# EAGLE schematic HotFireBoard (EAGLE 9.0.1)
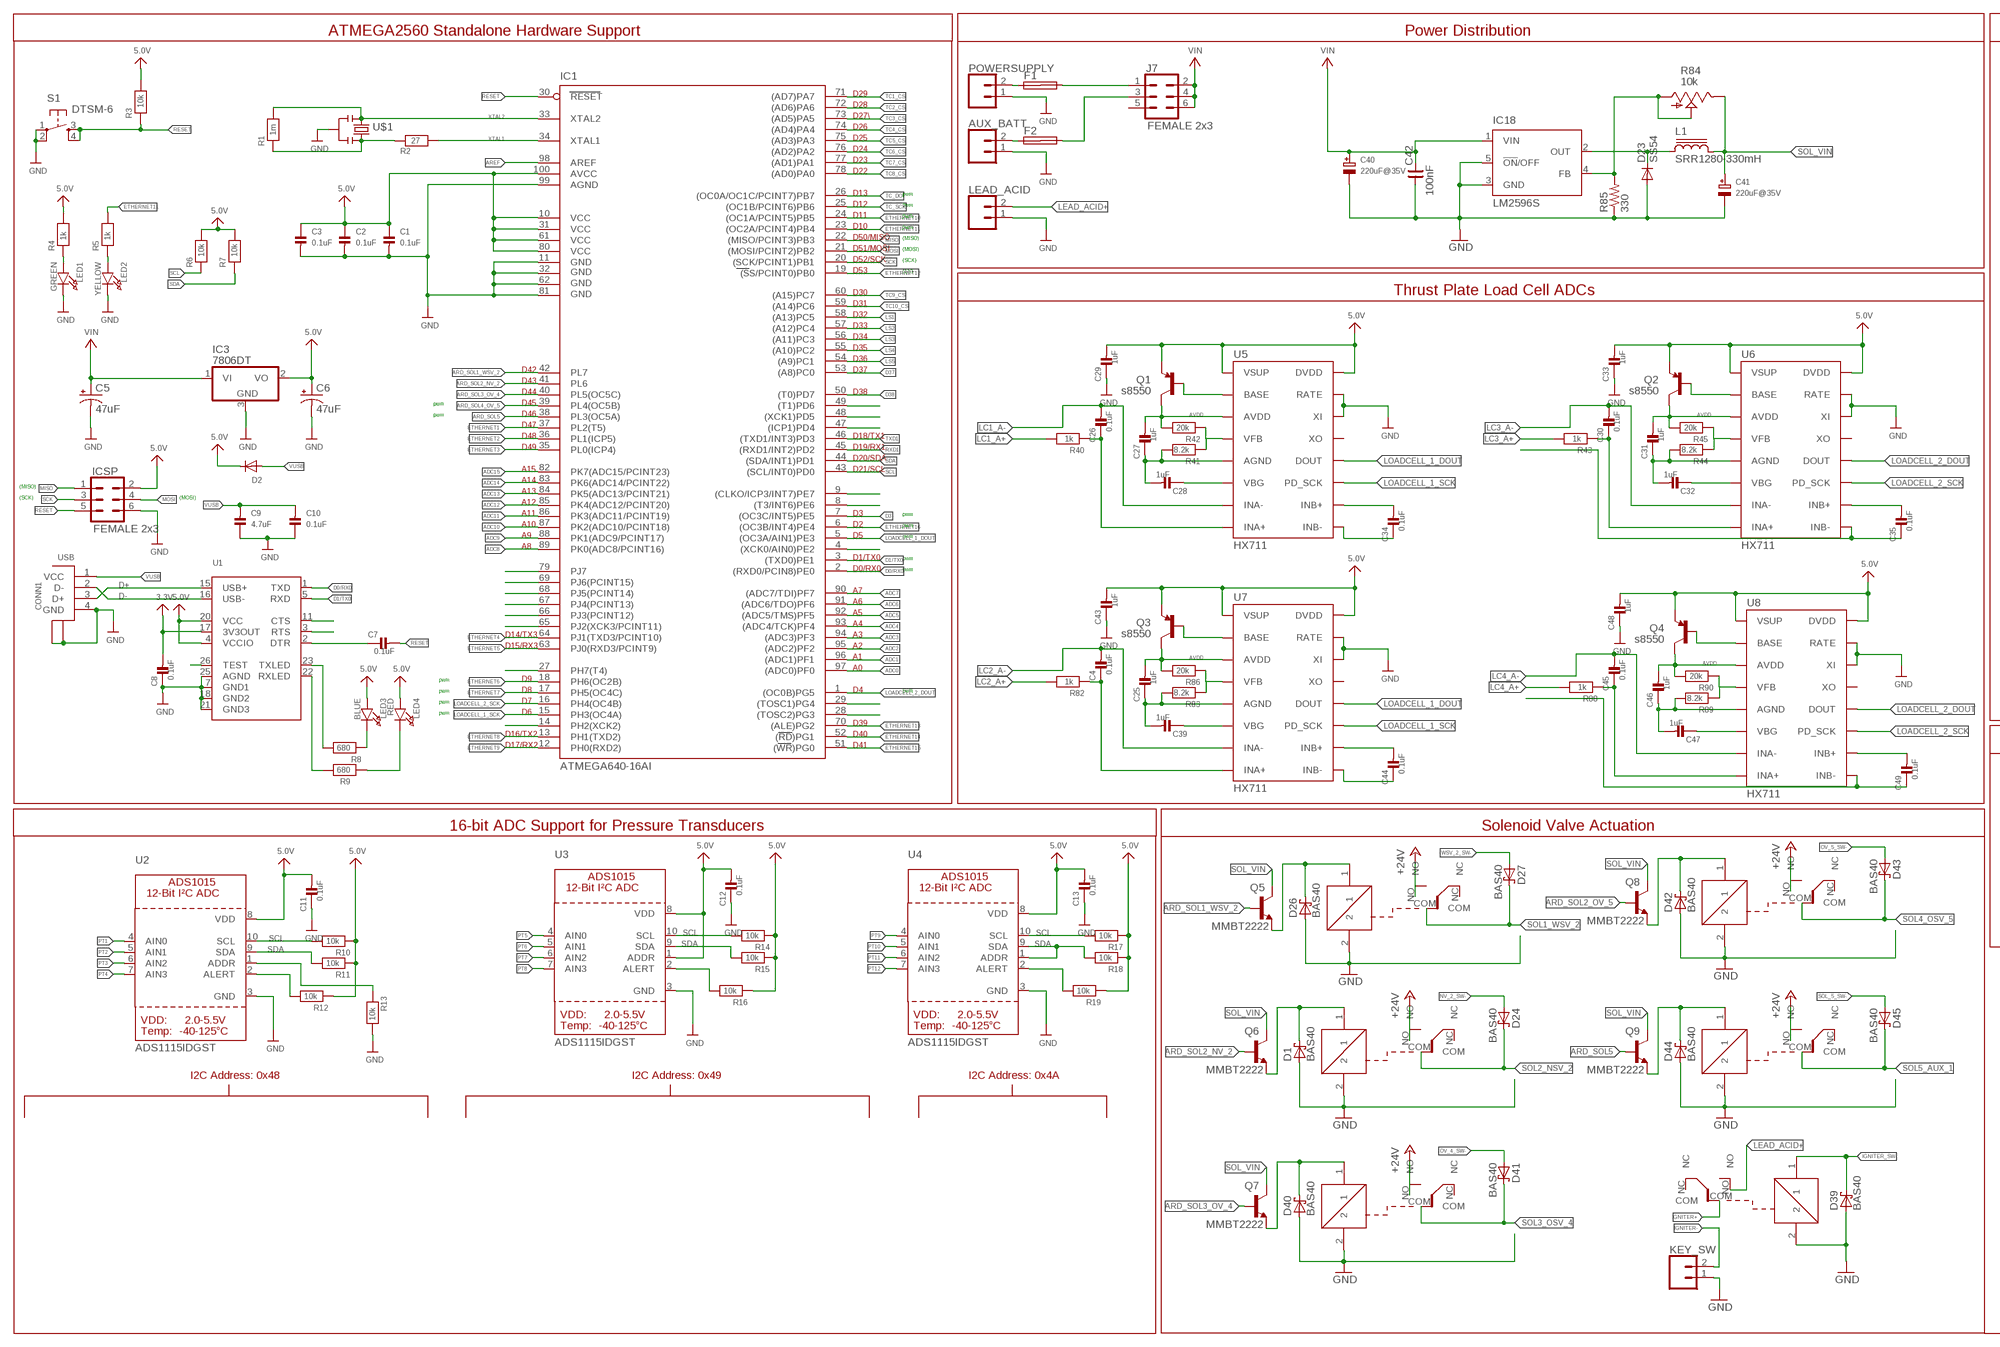
[diagram p0: schematic, sheet 1, part 1 of 3]
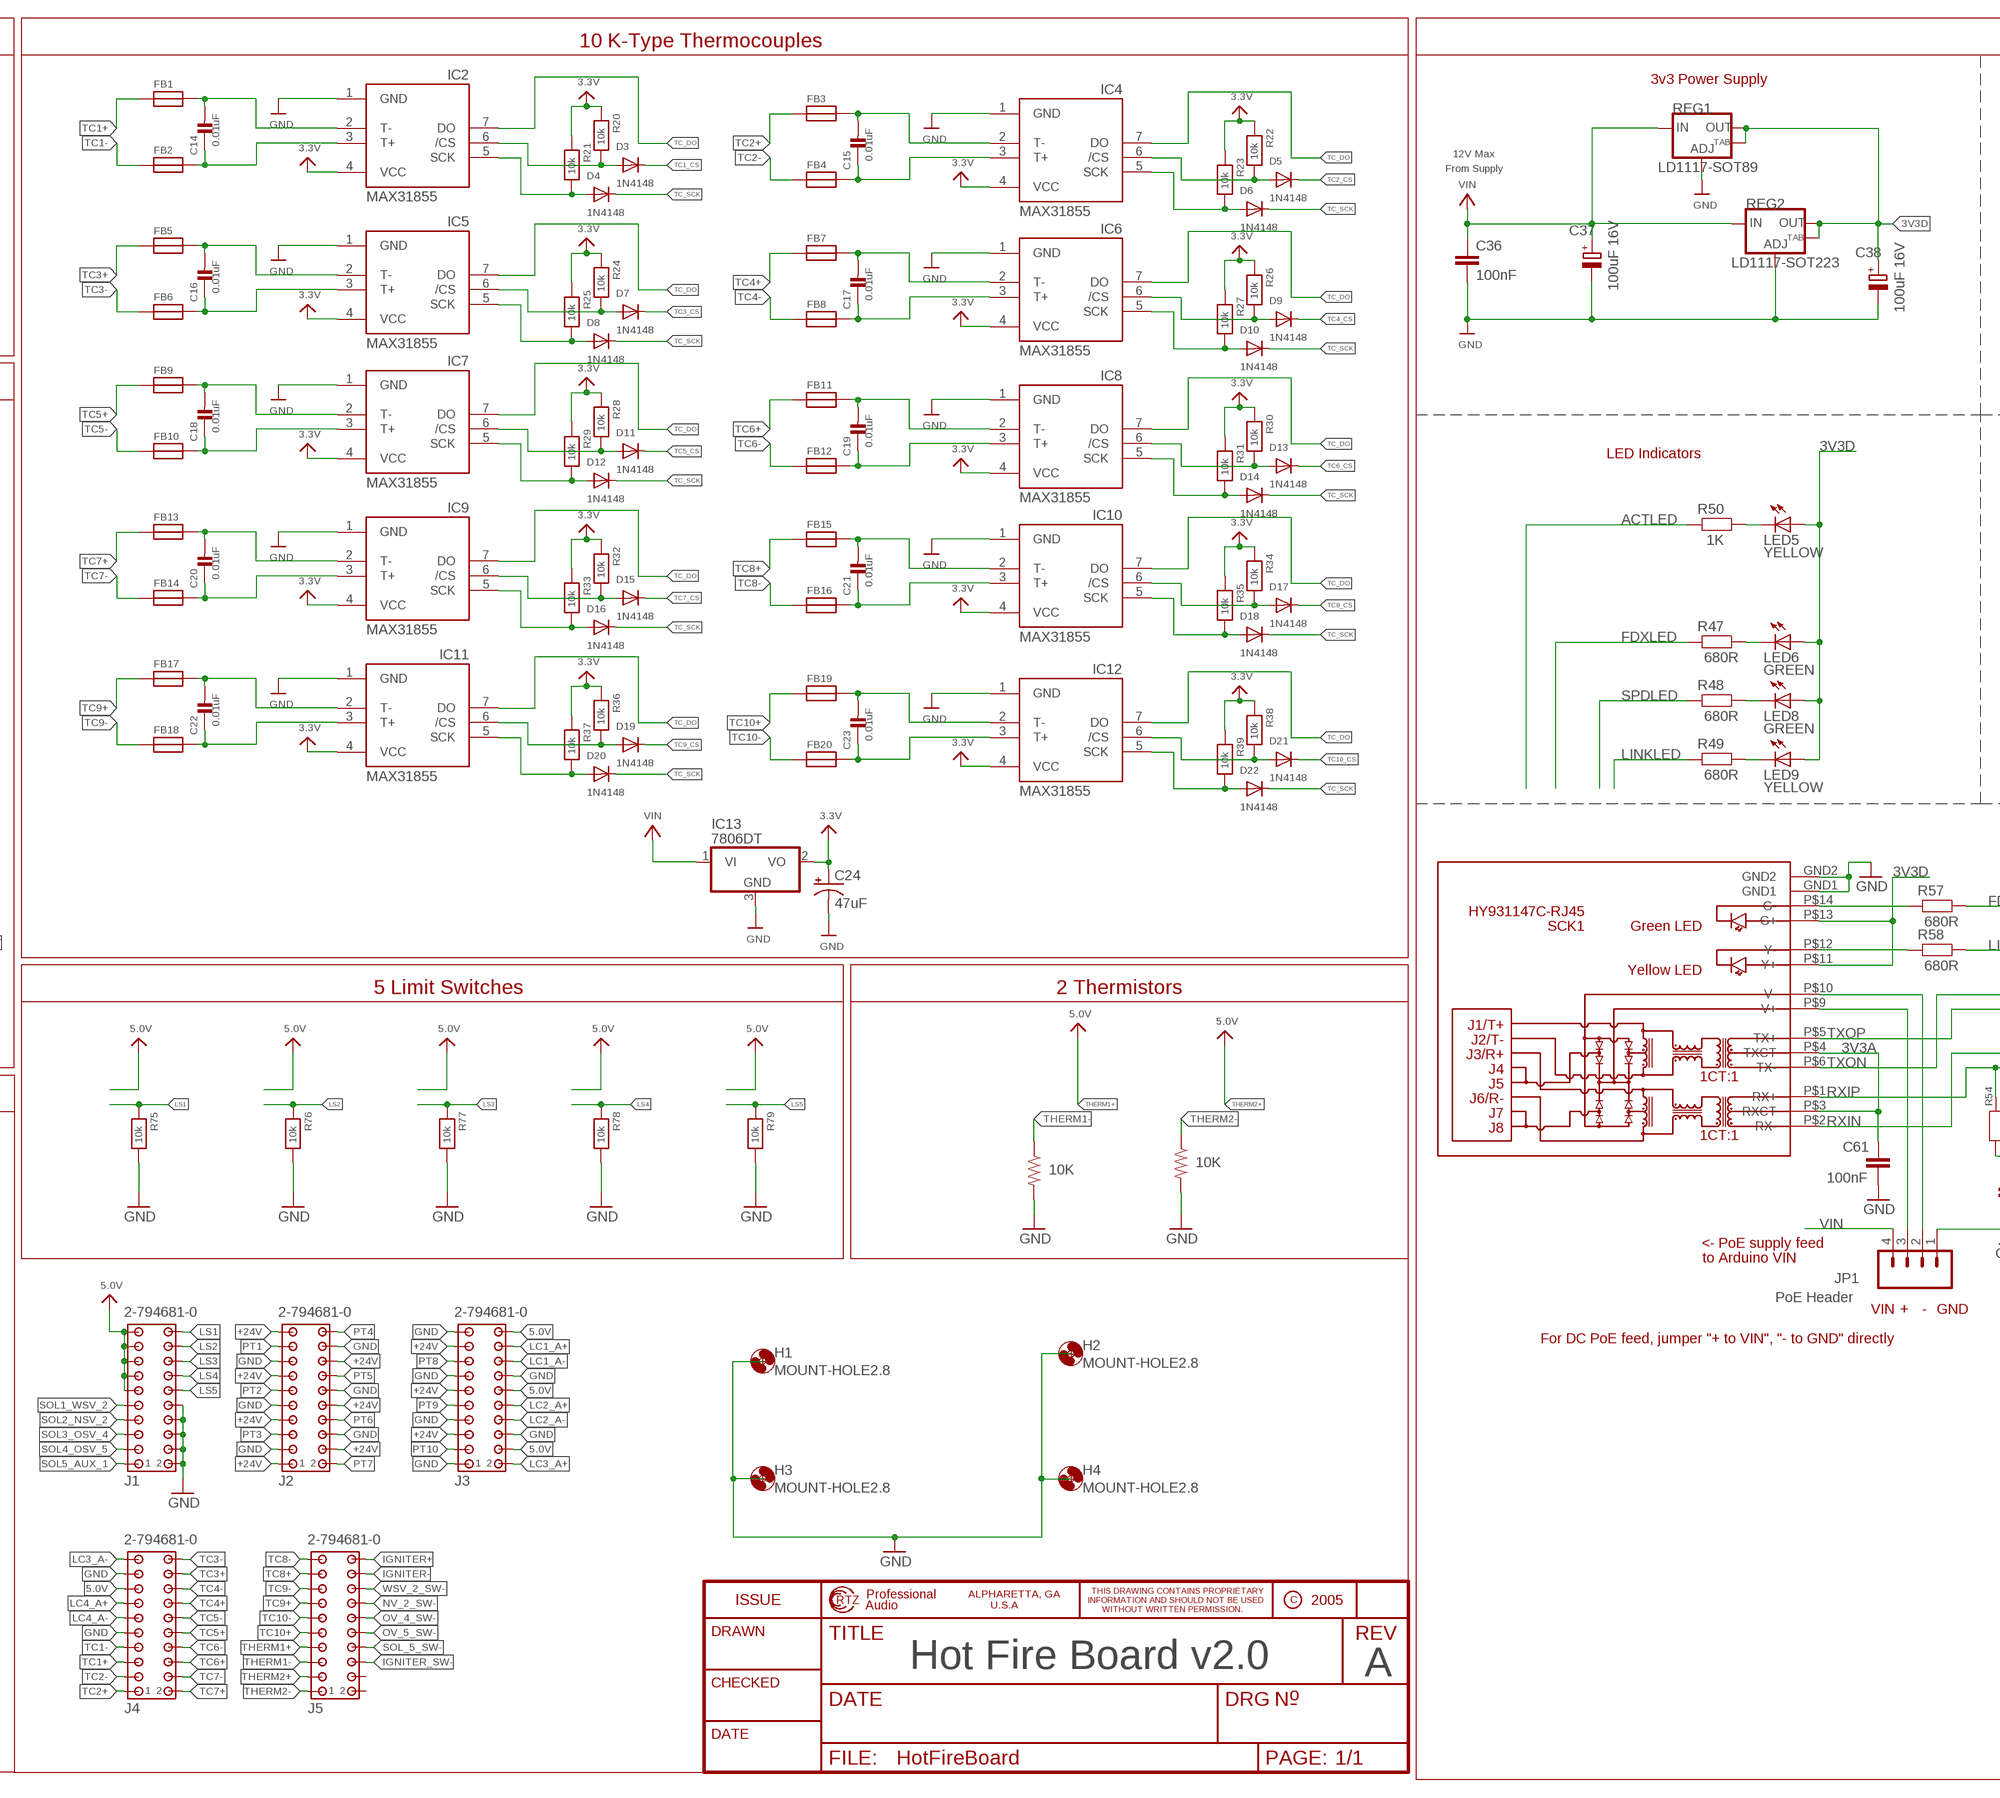
[diagram p1: schematic, sheet 1, part 2 of 3]
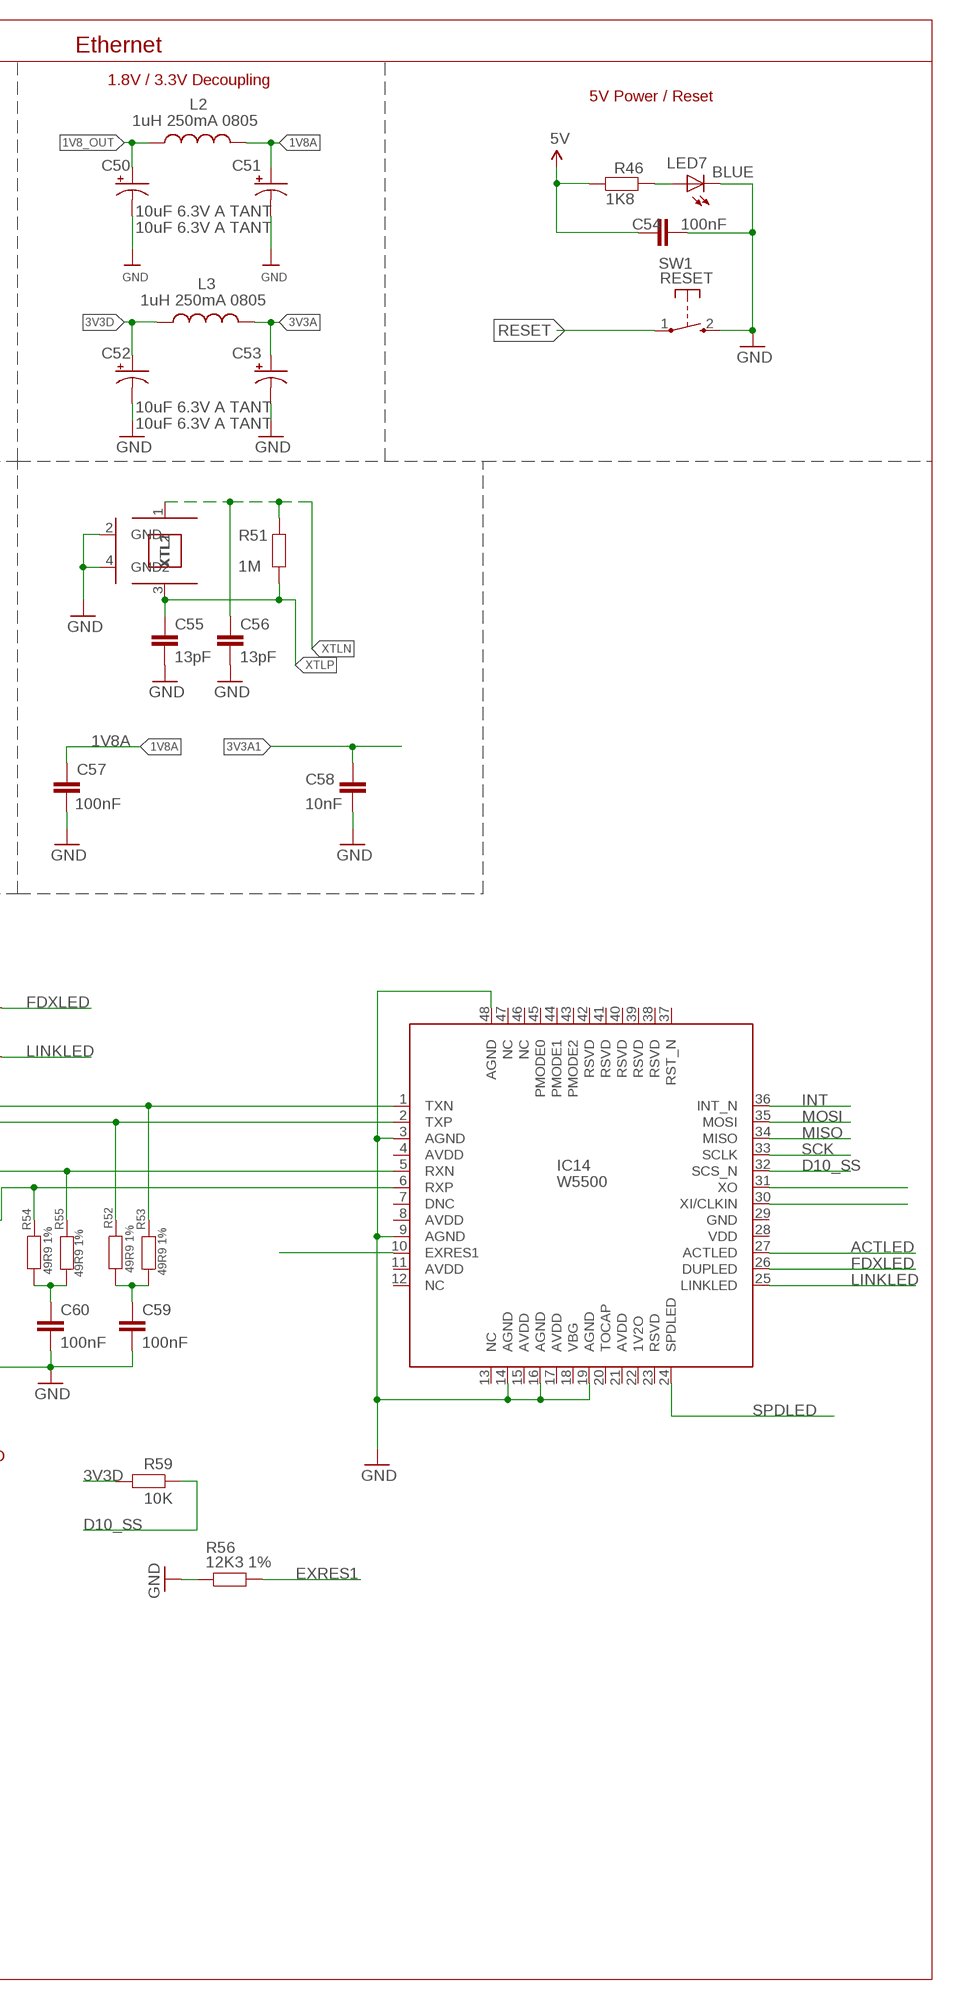
[diagram p2: schematic, sheet 1, part 3 of 3]

## Parts
AUX_BATT  CONN_025MM  [SCREWTERMINAL-5MM-2]
C1  0.1uF  CAP_CERAMIC0805  [0805]
C2  0.1uF  CAP_CERAMIC0805  [0805]
C3  0.1uF  CAP_CERAMIC0805  [0805]
C4  0.1uF  CAP_CERAMIC0805  [0805]
C5  47uF  CPOL-USD  [PANASONIC_D]
C6  47uF  CPOL-USD  [PANASONIC_D]
C7  0.1uF  CAP_CERAMIC0805  [0805]
C8  0.1uF  CAP_CERAMIC0805  [0805]
C9  4.7uF  CAP_CERAMIC0805  [0805]
C10  0.1uF  CAP_CERAMIC0805  [0805]
C11  0.1uF  CAP_CERAMIC0805  [0805]
C12  0.1uF  CAP_CERAMIC0805  [0805]
C13  0.1uF  CAP_CERAMIC0805  [0805]
C14  0.01uF  CAP_CERAMIC0805  [0805]
C15  0.01uF  CAP_CERAMIC0805  [0805]
C16  0.01uF  CAP_CERAMIC0805  [0805]
C17  0.01uF  CAP_CERAMIC0805  [0805]
C18  0.01uF  CAP_CERAMIC0805  [0805]
C19  0.01uF  CAP_CERAMIC0805  [0805]
C20  0.01uF  CAP_CERAMIC0805  [0805]
C21  0.01uF  CAP_CERAMIC0805  [0805]
C22  0.01uF  CAP_CERAMIC0805  [0805]
C23  0.01uF  CAP_CERAMIC0805  [0805]
C24  47uF  CPOL-USD  [PANASONIC_D]
C25  1uF  CAP_CERAMIC0805  [0805]
C26  0.1uF  CAP_CERAMIC0805  [0805]
C27  1uF  CAP_CERAMIC0805  [0805]
C28  1uF  CAP_CERAMIC0805  [0805]
C29  1uF  CAP_CERAMIC0805  [0805]
C30  0.1uF  CAP_CERAMIC0805  [0805]
C31  1uF  CAP_CERAMIC0805  [0805]
C32  1uF  CAP_CERAMIC0805  [0805]
C33  1uF  CAP_CERAMIC0805  [0805]
C34  0.1uF  CAP_CERAMIC0805  [0805]
C35  0.1uF  CAP_CERAMIC0805  [0805]
C36  100nF  CAP0603  [0603]
C37  100uF 16V  CPOL-EUD  [PANASONIC_D]
C38  100uF 16V  CPOL-EUD  [PANASONIC_D]
C39  1uF  CAP_CERAMIC0805  [0805]
C40  220uF@35V  CAP_ELECTROLYTICPANASONIC_D  [PANASONIC_D]
C41  220uF@35V  CAP_ELECTROLYTICPANASONIC_D  [PANASONIC_D]
C42  100nF  CNP-0603  [0603]
C43  1uF  CAP_CERAMIC0805  [0805]
C44  0.1uF  CAP_CERAMIC0805  [0805]
C45  0.1uF  CAP_CERAMIC0805  [0805]
C46  1uF  CAP_CERAMIC0805  [0805]
C47  1uF  CAP_CERAMIC0805  [0805]
C48  1uF  CAP_CERAMIC0805  [0805]
C49  0.1uF  CAP_CERAMIC0805  [0805]
C50  10uF 6.3V A TANT  CAP_POL1206  [EIA3216]
C51  10uF 6.3V A TANT  CAP_POL1206  [EIA3216]
C52  10uF 6.3V A TANT  CAP_POL1206  [EIA3216]
C53  10uF 6.3V A TANT  CAP_POL1206  [EIA3216]
C54  100nF  CAP0603  [0603]
C55  13pF  CAP0603  [0603]
C56  13pF  CAP0603  [0603]
C57  100nF  CAP0603  [0603]
C58  10nF  CAP0603  [0603]
C59  100nF  CAP0603  [0603]
C60  100nF  CAP0603  [0603]
C61  100nF  CAP0603  [0603]
CONN1  USB  [PN61729]
D1  BAS40  [SOT23]
D2  DIODESOD-123  [SOD-123]
D3  1N4148  DIODESOD-123  [SOD-123]
D4  1N4148  DIODESOD-123  [SOD-123]
D5  1N4148  DIODESOD-123  [SOD-123]
D6  1N4148  DIODESOD-123  [SOD-123]
D7  1N4148  DIODESOD-123  [SOD-123]
D8  1N4148  DIODESOD-123  [SOD-123]
D9  1N4148  DIODESOD-123  [SOD-123]
D10  1N4148  DIODESOD-123  [SOD-123]
D11  1N4148  DIODESOD-123  [SOD-123]
D12  1N4148  DIODESOD-123  [SOD-123]
D13  1N4148  DIODESOD-123  [SOD-123]
D14  1N4148  DIODESOD-123  [SOD-123]
D15  1N4148  DIODESOD-123  [SOD-123]
D16  1N4148  DIODESOD-123  [SOD-123]
D17  1N4148  DIODESOD-123  [SOD-123]
D18  1N4148  DIODESOD-123  [SOD-123]
D19  1N4148  DIODESOD-123  [SOD-123]
D20  1N4148  DIODESOD-123  [SOD-123]
D21  1N4148  DIODESOD-123  [SOD-123]
D22  1N4148  DIODESOD-123  [SOD-123]
D23  SS54  S3G  [DO214AB]
D24  BAS40  [SOT23]
D26  BAS40  [SOT23]
D27  BAS40  [SOT23]
D39  BAS40  [SOT23]
D40  BAS40  [SOT23]
D41  BAS40  [SOT23]
D42  BAS40  [SOT23]
D43  BAS40  [SOT23]
D44  BAS40  [SOT23]
D45  BAS40  [SOT23]
F1  SHK20L  [SHK20L]
F2  SHK20L  [SHK20L]
FB1  FERRITE  [0603]
FB2  FERRITE  [0603]
FB3  FERRITE  [0603]
FB4  FERRITE  [0603]
FB5  FERRITE  [0603]
FB6  FERRITE  [0603]
FB7  FERRITE  [0603]
FB8  FERRITE  [0603]
FB9  FERRITE  [0603]
FB10  FERRITE  [0603]
FB11  FERRITE  [0603]
FB12  FERRITE  [0603]
FB13  FERRITE  [0603]
FB14  FERRITE  [0603]
FB15  FERRITE  [0603]
FB16  FERRITE  [0603]
FB17  FERRITE  [0603]
FB18  FERRITE  [0603]
FB19  FERRITE  [0603]
FB20  FERRITE  [0603]
H1  MOUNT-HOLE2.8  [2,8]
H2  MOUNT-HOLE2.8  [2,8]
H3  MOUNT-HOLE2.8  [2,8]
H4  MOUNT-HOLE2.8  [2,8]
IC1  ATMEGA640-16AI  [TQFP100]
IC2  MAX31855  MAX6675  [SO08]
IC3  7806DT  [TO252]
IC4  MAX31855  MAX6675  [SO08]
IC5  MAX31855  MAX6675  [SO08]
IC6  MAX31855  MAX6675  [SO08]
IC7  MAX31855  MAX6675  [SO08]
IC8  MAX31855  MAX6675  [SO08]
IC9  MAX31855  MAX6675  [SO08]
IC10  MAX31855  MAX6675  [SO08]
IC11  MAX31855  MAX6675  [SO08]
IC12  MAX31855  MAX6675  [SO08]
IC13  7806DT  [TO252]
IC14  W5500  [W5500]
IC18  LM2596S  [TO263-5]
ICSP  FEMALE 2x3  CONN_03X2FEMALE  [2X3]
J1  2-794681-0  [2-794681-0]
J2  2-794681-0  [2-794681-0]
J3  2-794681-0  [2-794681-0]
J4  2-794681-0  [2-794681-0]
J5  2-794681-0  [2-794681-0]
J7  FEMALE 2x3  CONN_03X2FEMALE  [2X3]
JP1  PoE Header  M04PTH  [1X04]
KEY_SW  CONN_025MM  [SCREWTERMINAL-5MM-2]
L1  SRR1280-330mH  SRR1280  [SRR1280]
L2  1uH 250mA 0805  L-USL2012C  [L2012C]
L3  1uH 250mA 0805  L-USL2012C  [L2012C]
LEAD_ACID  CONN_025MM  [SCREWTERMINAL-5MM-2]
LED1  GREEN  LED0805  [CHIPLED_0805]
LED2  YELLOW  LED0805  [CHIPLED_0805]
LED3  BLUE  LED0805  [CHIPLED_0805]
LED4  RED  LED0805  [CHIPLED_0805]
LED5  YELLOW  LED0603  [LED-0603]
LED6  GREEN  LED0603  [LED-0603]
LED7  BLUE  LED0603  [LED-0603]
LED8  GREEN  LED0603  [LED-0603]
LED9  YELLOW  LED0603  [LED-0603]
POWERSUPPLY  CONN_025MM  [SCREWTERMINAL-5MM-2]
Q1  s8550  TRANSISTOR_PNPTO92  [TO-92]
Q2  s8550  TRANSISTOR_PNPTO92  [TO-92]
Q3  s8550  TRANSISTOR_PNPTO92  [TO-92]
Q4  s8550  TRANSISTOR_PNPTO92  [TO-92]
Q5  MMBT2222  TRANSISTOR_NPN  [SOT223]
Q6  MMBT2222  TRANSISTOR_NPN  [SOT223]
Q7  MMBT2222  TRANSISTOR_NPN  [SOT223]
Q8  MMBT2222  TRANSISTOR_NPN  [SOT223]
Q9  MMBT2222  TRANSISTOR_NPN  [SOT223]
R1  1m  RESISTOR0805  [0805]
R2  27  RESISTOR0805  [0805]
R3  10k  RESISTOR0805  [0805]
R4  1k  RESISTOR0805  [0805]
R5  1k  RESISTOR0805  [0805]
R6  10k  RESISTOR0805  [0805]
R7  10k  RESISTOR0805  [0805]
R8  680  RESISTOR0805  [0805]
R9  680  RESISTOR0805  [0805]
R10  10k  RESISTOR0805  [0805]
R11  10k  RESISTOR0805  [0805]
R12  10k  RESISTOR0805  [0805]
R13  10k  RESISTOR0805  [0805]
R14  10k  RESISTOR0805  [0805]
R15  10k  RESISTOR0805  [0805]
R16  10k  RESISTOR0805  [0805]
R17  10k  RESISTOR0805  [0805]
R18  10k  RESISTOR0805  [0805]
R19  10k  RESISTOR0805  [0805]
R20  10k  RESISTOR0805  [0805]
R21  10k  RESISTOR0805  [0805]
R22  10k  RESISTOR0805  [0805]
R23  10k  RESISTOR0805  [0805]
R24  10k  RESISTOR0805  [0805]
R25  10k  RESISTOR0805  [0805]
R26  10k  RESISTOR0805  [0805]
R27  10k  RESISTOR0805  [0805]
R28  10k  RESISTOR0805  [0805]
R29  10k  RESISTOR0805  [0805]
R30  10k  RESISTOR0805  [0805]
R31  10k  RESISTOR0805  [0805]
R32  10k  RESISTOR0805  [0805]
R33  10k  RESISTOR0805  [0805]
R34  10k  RESISTOR0805  [0805]
R35  10k  RESISTOR0805  [0805]
R36  10k  RESISTOR0805  [0805]
R37  10k  RESISTOR0805  [0805]
R38  10k  RESISTOR0805  [0805]
R39  10k  RESISTOR0805  [0805]
R40  1k  RESISTOR0805  [0805]
R41  8.2k  RESISTOR0805  [0805]
R42  20k  RESISTOR0805  [0805]
R43  1k  RESISTOR0805  [0805]
R44  8.2k  RESISTOR0805  [0805]
R45  20k  RESISTOR0805  [0805]
R46  1K8  RESISTOR0603  [0603]
R47  680R  RESISTOR0603  [0603]
R48  680R  RESISTOR0603  [0603]
R49  680R  RESISTOR0603  [0603]
R50  1K  RESISTOR0603  [0603]
R51  1M  RESISTOR0603  [0603]
R52  49R9 1%  RESISTOR0603  [0603]
R53  49R9 1%  RESISTOR0603  [0603]
R54  49R9 1%  RESISTOR0603  [0603]
R55  49R9 1%  RESISTOR0603  [0603]
R56  12K3 1%  RESISTOR0603  [0603]
R57  680R  RESISTOR0603  [0603]
R58  680R  RESISTOR0603  [0603]
R59  10K  RESISTOR0603  [0603]
R75  10k  RESISTOR0805  [0805]
R76  10k  RESISTOR0805  [0805]
R77  10k  RESISTOR0805  [0805]
R78  10k  RESISTOR0805  [0805]
R79  10k  RESISTOR0805  [0805]
R80  10K  R-US_M0805  [M0805]
R81  10K  R-US_M0805  [M0805]
R82  1k  RESISTOR0805  [0805]
R83  8.2k  RESISTOR0805  [0805]
R84  10k  TRIM_US-S64W  [S64W]
R85  330  R-US_R0603  [R0603]
R86  20k  RESISTOR0805  [0805]
R88  1k  RESISTOR0805  [0805]
R89  8.2k  RESISTOR0805  [0805]
R90  20k  RESISTOR0805  [0805]
REG1  LD1117-SOT89  V_REG_LM1117SOT89  [SOT89]
REG2  LD1117-SOT223  V_REG_LM1117SOT223  [SOT223]
S1  DTSM-6  [DTSM-6]
SCK1  HY931147C-RJ45  [HY931147C]
SW1  RESET  TAC_SWITCH_2PIN  [TACTILE_SWITCH_SMD_2PIN_TINY]
U1  FT232RLSSOP28  [SSOP28DB]
U2  ADS1115IDGST  ADC_ADS1015  [MSOP10]
U3  ADS1115IDGST  ADC_ADS1015  [MSOP10]
U4  ADS1115IDGST  ADC_ADS1015  [MSOP10]
U5  HX711  [SO16]
U6  HX711  [SO16]
U7  HX711  [SO16]
U8  HX711  [SO16]
U$1  RESONATORSMD  [RESONATOR-SMD]
U$15  RW-SH  [RW-SH]
U$17  RW-SH  [RW-SH]
U$19  RW-SH  [RW-SH]
U$21  RW-SH  [RW-SH]
U$128  RW-SH  [RW-SH]
U$138  RW-SH  [RW-SH]
XTL1  25MHZ  CRYSTAL-GND3X2  [CRYSTAL-SMD-3X2]

## Nets
1V8_OUT: C50.A(+) L2.1
1V8A: C51.A(+) C57.1 L2.2
3.3V [16mil]: C8.2 C24.+ IC2.4(VCC) IC4.4(VCC) IC5.4(VCC) IC6.4(VCC) IC7.4(VCC) IC8.4(VCC) IC9.4(VCC) IC10.4(VCC) IC11.4(VCC) IC12.4(VCC) IC13.2(VO) R20.1 R21.1 R22.1 R23.1 R24.1 R25.1 R26.1 R27.1 R28.1 R29.1 R30.1 R31.1 R32.1 R33.1 R34.1 R35.1 R36.1 R37.1 R38.1 R39.1 U1.17(3V3OUT)
3V3A: C53.A(+) C61.1 L3.2 SCK1.P$3(RXCT) SCK1.P$4(TXCT)
3V3A1: C58.1
3V3D: C38.+ C52.A(+) L3.1 LED5.A LED6.A LED8.A LED9.A R59.2 REG1.2(OUT) REG1.4(OUT) REG2.2(OUT) REG2.4(OUT) SCK1.P$11(Y+) SCK1.P$13(G+)
5.0V [16mil]: C1.1 C2.1 C3.1 C6.+ C11.2 C12.2 C13.2 C29.2 C33.2 C43.2 C48.2 D2.C IC1.10(VCC) IC1.31(VCC1) IC1.61(VCC2) IC1.80(VCC3) IC1.100(AVCC) IC3.2(VO) ICSP.2 J1.11 J1.13 J1.15 J1.17 J1.19 J3.4 J3.12 J3.20 J4.15 LED3.A LED4.A Q1.1(E) Q2.1(E) Q3.1(E) Q4.1(E) R3.2 R4.2 R6.2 R7.2 R10.1 R11.1 R12.1 R14.1 R15.1 R16.1 R17.1 R18.1 R19.1 U1.4(VCCIO) U1.20(VCC) U2.8(VDD) U3.1(ADDR) U3.8(VDD) U4.8(VDD) U5.1(VSUP) U5.16(DVDD) U6.1(VSUP) U6.16(DVDD) U7.1(VSUP) U7.16(DVDD) U8.1(VSUP) U8.16(DVDD)
5V: C54.1 R46.1
+24V [24mil]: J2.1 J2.4 J2.7 J2.10 J2.13 J2.16 J2.19 J3.5 J3.11 J3.17 U$15.NO U$17.NO U$19.NO U$21.NO U$128.NO
ACTLED: IC14.27(ACTLED) R50.2
ADC0: IC1.97((ADC0)PF0)
ADC1: IC1.96((ADC1)PF1)
ADC2: IC1.95((ADC2)PF2)
ADC3: IC1.94((ADC3)PF3)
ADC4: IC1.93((ADC4/TCK)PF4)
ADC5: IC1.92((ADC5/TMS)PF5)
ADC6: IC1.91((ADC6/TDO)PF6)
ADC7: IC1.90((ADC7/TDI)PF7)
ADC8: IC1.89(PK0(ADC8/PCINT16))
ADC9: IC1.88(PK1(ADC9/PCINT17))
ADC10: IC1.87(PK2(ADC10/PCINT18))
ADC11: IC1.86(PK3(ADC11/PCINT19))
ADC12: IC1.85(PK4(ADC12/PCINT20))
ADC13: IC1.84(PK5(ADC13/PCINT21))
ADC14: IC1.83(PK6(ADC14/PCINT22))
ADC15: IC1.82(PK7(ADC15/PCINT23))
ARD_SOL1_WSV_2: IC1.42(PL7) Q5.1(B)
ARD_SOL2_NV_2: IC1.41(PL6) Q6.1(B)
ARD_SOL2_OV_5: Q8.1(B)
ARD_SOL3_OV_4: IC1.40(PL5(OC5C)) Q7.1(B)
ARD_SOL4_OV_5: IC1.39(PL4(OC5B))
ARD_SOL5: IC1.38(PL3(OC5A)) Q9.1(B)
AREF: IC1.98(AREF)
AVDD: C25.2 C27.2 C31.2 C46.2 Q1.3(C) Q2.3(C) Q3.3(C) Q4.3(C) R42.2 R45.2 R86.2 R90.2 U5.3(AVDD) U6.3(AVDD) U7.3(AVDD) U8.3(AVDD)
D0/RX0: IC1.2((RXD0/PCIN8)PE0) U1.1(TXD)
D1/TX0: IC1.3((TXD0)PE1) U1.5(RXD)
D3: IC1.7((OC3C/INT5)PE5)
D10_SS: IC14.32(SCS_N) R59.1
D37: IC1.53((A8)PC0)
D38: IC1.50((T0)PD7)
D+: CONN1.3(D+) U1.15(USB+)
D-: CONN1.2(D-) U1.16(USB-)
ETHERNET1: IC1.37(PL2(T5))
ETHERNET2: IC1.36(PL1(ICP5))
ETHERNET3: IC1.35(PL0(ICP4))
ETHERNET4: IC1.64(PJ1(TXD3/PCINT10))
ETHERNET5: IC1.63(PJ0(RXD3/PCINT9))
ETHERNET6: IC1.18(PH6(OC2B))
ETHERNET7: IC1.17(PH5(OC4C))
ETHERNET8: IC1.13(PH1(TXD2))
ETHERNET9: IC1.12(PH0(RXD2))
ETHERNET10: IC1.24((OC1A/PCINT5)PB5)
ETHERNET11: IC1.23((OC2A/PCINT4)PB4) R5.2
ETHERNET12: IC1.19((SS/PCINT0)PB0)
ETHERNET13: IC1.70((ALE)PG2)
ETHERNET14: IC1.52((RD)PG1)
ETHERNET15: IC1.51((WR)PG0)
ETHERNET16: IC1.6((OC3B/INT4)PE4)
EXRES1: IC14.10(EXRES1) R56.2
FDXLED: IC14.26(DUPLED) R47.2 R57.1
GND [32mil]: AUX_BATT.1 C1.2 C2.2 C3.2 C5.- C6.- C8.1 C9.1 C10.1 C11.1 C12.1 C13.1 C24.- C29.1 C33.1 C36.2 C37.- C38.- C40.- C41.- C42.1 C43.1 C48.1 C50.C(-) C51.C(-) C52.C(-) C53.C(-) C54.2 C55.2 C56.2 C57.2 C58.2 C59.2 C60.2 C61.2 CONN1.4(GND) CONN1.P$1 CONN1.P$2 D1.1(A) D23.A D26.1(A) D39.1(A) D40.1(A) D42.1(A) D44.1(A) IC1.11(GND) IC1.32(GND1) IC1.62(GND2) IC1.81(GND3) IC1.99(AGND) IC2.1(GND) IC3.3(GND) IC4.1(GND) IC5.1(GND) IC6.1(GND) IC7.1(GND) IC8.1(GND) IC9.1(GND) IC10.1(GND) IC11.1(GND) IC12.1(GND) IC13.3(GND) IC14.3(AGND) IC14.9(AGND) IC14.14(AGND) IC14.16(AGND) IC14.19(AGND) IC14.48(AGND) IC18.3(GND) IC18.5(!ON!/OFF) ICSP.6 J1.2 J1.4 J1.6 J1.8 J1.10 J2.3 J2.6 J2.9 J2.12 J2.15 J2.18 J3.1 J3.6 J3.7 J3.13 J3.14 J3.19 J4.9 J4.17 JP1.1 KEY_SW.1 LEAD_ACID.1 LED1.C LED2.C LED7.C POWERSUPPLY.1 R13.2 R56.1 R75.2 R76.2 R77.2 R78.2 R79.2 R80.2 R81.2 R85.1 REG1.1(ADJ) REG2.1(ADJ) S1.1 S1.2 SCK1.GND1 SCK1.GND2 SW1.2(S) U1.7(GND1) U1.18(GND2) U1.21(GND3) U1.25(AGND) U2.3(GND) U3.3(GND) U4.3(GND) U5.14(XI) U5.15(RATE) U6.14(XI) U6.15(RATE) U7.14(XI) U7.15(RATE) U8.14(XI) U8.15(RATE) U$1.2 U$15.2 U$17.2 U$19.2 U$21.2 U$128.2 U$138.2 XTL1.2(GND) XTL1.4(GND2)
IGNITER+ [32mil]: J5.20 U$138.COM
IGNITER-: J5.18 KEY_SW.2
IGNITER_SW- [32mil]: D39.3(C) J5.6 U$138.1
INT: IC14.36(INT_N)
LC1_A+: J3.18 R40.2
LC1_A-: C26.2 J3.16 U5.7(INA-)
LC2_A+: J3.10 R82.2
LC2_A-: C4.2 J3.8 U7.7(INA-)
LC3_A+: J3.2 R43.2
LC3_A-: C30.2 J4.19 U6.7(INA-)
LC4_A+: J4.13 R88.2
LC4_A-: C45.2 J4.11 U8.7(INA-)
LEAD_ACID+ [32mil]: LEAD_ACID.2 U$138.NO
LINKLED: IC14.25(LINKLED) R49.2 R58.1
LOADCELL_1_DOUT: IC1.5((OC3A/AIN1)PE3) U5.12(DOUT) U7.12(DOUT)
LOADCELL_1_SCK: IC1.15(PH3(OC4A)) U5.11(PD_SCK) U7.11(PD_SCK)
LOADCELL_2_DOUT: IC1.1((OC0B)PG5) U6.12(DOUT) U8.12(DOUT)
LOADCELL_2_SCK: IC1.16(PH4(OC4B)) U6.11(PD_SCK) U8.11(PD_SCK)
LS1: IC1.58((A13)PC5) J1.20 R75.1
LS2: IC1.57((A12)PC4) J1.18 R76.1
LS3: IC1.56((A11)PC3) J1.16 R77.1
LS4: IC1.55((A10)PC2) J1.14 R78.1
LS5: IC1.54((A9)PC1) J1.12 R79.1
MISO: IC1.22((MISO/PCINT3)PB3) IC14.34(MISO) ICSP.1
MOSI: IC1.21((MOSI/PCINT2)PB2) IC14.35(MOSI) ICSP.4
N$1: IC1.65(PJ2(XCK3/PCINT11))
N$2: IC1.66(PJ3(PCINT12))
N$3: R1.1 R2.2 U$1.3
N$4: IC1.67(PJ4(PCINT13))
N$5: IC1.68(PJ5(PCINT14))
N$6: IC1.69(PJ6(PCINT15))
N$7: IC1.79(PJ7)
N$8: IC1.27(PH7(T4))
N$9: IC1.9((CLKO/ICP3/INT7)PE7)
N$10: IC1.49((T1)PD6)
N$11: IC1.48((XCK1)PD5)
N$12: IC1.47((ICP1)PD4)
N$13: IC1.14(PH2(XCK2))
N$14: IC1.8((T3/INT6)PE6)
N$15 [24mil]: F1.1A POWERSUPPLY.2
N$16 [24mil]: AUX_BATT.2 F2.1A
N$17 [24mil]: F1.2A J7.1
N$18: IC1.4((XCK0/AIN0)PE2)
N$19: LED1.A R4.1
N$20: LED2.A R5.1
N$21: LED3.C R8.1
N$22: R9.2 U1.22(RXLED)
N$23: R8.2 U1.23(TXLED)
N$24: LED4.C R9.1
N$25: IC1.29((TOSC1)PG4)
N$26: IC1.28((TOSC2)PG3)
N$27: C14.1 FB2.2 IC2.3(T+)
N$28: U1.26(TEST)
N$29: U1.11(CTS)
N$30: U1.3(RTS)
N$31: C7.1 U1.2(DTR)
N$32: C14.2 FB1.2 IC2.2(T-)
N$33 [24mil]: F2.2A J7.3
N$34: D3.A IC2.6(/CS) R20.2
N$35: C59.1 R52.1 R53.2
N$36: C4.1 R82.1 U7.8(INA+)
N$37: D23.C IC18.2(OUT) L1.1
N$38: R12.2 U2.2(ALERT)
N$39: IC18.4(FB) R84.A R84.S R85.2
N$40: R16.2 U3.2(ALERT)
N$41: R13.1 U2.1(ADDR)
N$42: R57.2 SCK1.P$14(G-)
N$43: JP1.3 SCK1.P$9(V+)
N$44: R19.2 U4.2(ALERT)
N$45: C25.1 C39.2 R83.2 U7.5(AGND)
N$46: JP1.2 SCK1.P$10(V-)
N$47: D4.A IC2.5(SCK) R21.2
N$48: C15.2 FB3.2 IC4.2(T-)
N$49: C39.1 U7.6(VBG)
N$50: R83.1 R86.1 U7.4(VFB)
N$51: C15.1 FB4.2 IC4.3(T+)
N$52: IC14.31(XO)
N$54: D5.A IC4.6(/CS) R22.2
N$55: D6.A IC4.5(SCK) R23.2
N$56: C16.2 FB5.2 IC5.2(T-)
N$57: C16.1 FB6.2 IC5.3(T+)
N$60: D7.A IC5.6(/CS) R24.2
N$61: D8.A IC5.5(SCK) R25.2
N$62: C17.2 FB7.2 IC6.2(T-)
N$63: C17.1 FB8.2 IC6.3(T+)
N$66: D9.A IC6.6(/CS) R26.2
N$67: D10.A IC6.5(SCK) R27.2
N$68: C18.2 FB9.2 IC7.2(T-)
N$69: C18.1 FB10.2 IC7.3(T+)
N$71: IC14.30(XI/CLKIN)
N$72: D11.A IC7.6(/CS) R28.2
N$73: D12.A IC7.5(SCK) R29.2
N$74: C19.2 FB11.2 IC8.2(T-)
N$75: C19.1 FB12.2 IC8.3(T+)
N$78: D13.A IC8.6(/CS) R30.2
N$79: D14.A IC8.5(SCK) R31.2
N$80: C20.2 FB13.2 IC9.2(T-)
N$81: C20.1 FB14.2 IC9.3(T+)
N$84: D15.A IC9.6(/CS) R32.2
N$85: D16.A IC9.5(SCK) R33.2
N$86: C21.2 FB15.2 IC10.2(T-)
N$87: C21.1 FB16.2 IC10.3(T+)
N$90: D17.A IC10.6(/CS) R34.2
N$91: D18.A IC10.5(SCK) R35.2
N$92: C22.2 FB17.2 IC11.2(T-)
N$93: C22.1 FB18.2 IC11.3(T+)
N$96: D19.A IC11.6(/CS) R36.2
N$97: D20.A IC11.5(SCK) R37.2
N$98: C23.2 FB19.2 IC12.2(T-)
N$99: C23.1 FB20.2 IC12.3(T+)
N$102: D21.A IC12.6(/CS) R38.2
N$103: D22.A IC12.5(SCK) R39.2
N$105: C26.1 R40.1 U5.8(INA+)
N$108: C27.1 C28.2 R41.2 U5.5(AGND)
N$109: C28.1 U5.6(VBG)
N$110: R41.1 R42.1 U5.4(VFB)
N$111: Q1.2(B) U5.2(BASE)
N$112: C30.1 R43.1 U6.8(INA+)
N$114: C31.1 C32.2 R44.2 U6.5(AGND)
N$115: C32.1 U6.6(VBG)
N$116: R44.1 R45.1 U6.4(VFB)
N$117: Q2.2(B) U6.2(BASE)
N$118: C34.1 U5.9(INB-)
N$119: C34.2 U5.10(INB+)
N$121: C35.1 U6.9(INB-)
N$122: C35.2 U6.10(INB+)
N$124: D26.3(C) Q5.3(E) U$128.1
N$126: D1.3(C) Q6.3(E) U$15.1
N$128: D40.3(C) Q7.3(E) U$17.1
N$130: D42.3(C) Q8.3(E) U$19.1
N$131: LED7.A R46.2
N$132: D44.3(C) Q9.3(E) U$21.1
N$157: Q3.2(B) U7.2(BASE)
N$158: C44.1 U7.9(INB-)
N$160: C44.2 U7.10(INB+)
N$163: C45.1 R88.1 U8.8(INA+)
N$165: C46.1 C47.2 R89.2 U8.5(AGND)
N$166: C47.1 U8.6(VBG)
N$167: R89.1 R90.1 U8.4(VFB)
N$168: Q4.2(B) U8.2(BASE)
N$169: C49.1 U8.9(INB-)
N$170: C49.2 U8.10(INB+)
N$321: C60.1 R54.1 R55.2
N$323: LED8.C R48.1
N$325: LED9.C R49.1
N$327: LED6.C R47.1
N$329: LED5.C R50.1
N$332: R58.2 SCK1.P$12(Y-)
NV_2_SW- [24mil]: D24.1(A) J5.14
OV_4_SW- [24mil]: D41.1(A) J5.12
OV_5_SW- [24mil]: D43.1(A) J5.10
PT1: J2.17 U2.4(AIN0)
PT2: J2.11 U2.5(AIN1)
PT3: J2.5 U2.6(AIN2)
PT4: J2.20 U2.7(AIN3)
PT5: J2.14 U3.4(AIN0)
PT6: J2.8 U3.5(AIN1)
PT7: J2.2 U3.6(AIN2)
PT8: J3.15 U3.7(AIN3)
PT9: J3.9 U4.4(AIN0)
PT10: J3.3 U4.5(AIN1)
PT11: U4.6(AIN2)
PT12: U4.7(AIN3)
RESET: C7.2 IC1.30(RESET) ICSP.5 R3.1 S1.3 S1.4 SW1.1(P)
RXD1: IC1.45((RXD1/INT2)PD2)
RXIN: IC14.5(RXN) R55.1 SCK1.P$2(RX-)
RXIP: IC14.6(RXP) R54.2 SCK1.P$1(RX+)
SCK: IC1.20((SCK/PCINT1)PB1) IC14.33(SCLK) ICSP.3
SCL: IC1.43((SCL/INT0)PD0) R6.1 R10.2 R14.2 R17.2 U2.10(SCL) U3.10(SCL) U4.10(SCL)
SDA: IC1.44((SDA/INT1)PD1) R7.1 R11.2 R15.2 R18.2 U2.9(SDA) U3.9(SDA) U4.1(ADDR) U4.9(SDA)
SOL1_WSV_2: D27.3(C) J1.9 U$128.COM
SOL2_NSV_2: D24.3(C) J1.7 U$15.COM
SOL3_OSV_4: D41.3(C) J1.5 U$17.COM
SOL4_OSV_5: D43.3(C) J1.3 U$19.COM
SOL5_AUX_1: D45.3(C) J1.1 U$21.COM
SOL_5_SW- [24mil]: D45.1(A) J5.8
SOL_VIN: C41.+ L1.2 Q5.2(C) Q6.2(C) Q7.2(C) Q8.2(C) Q9.2(C) R84.E
SPDLED: IC14.24(SPDLED) R48.2
TC1+: FB1.1 J4.5
TC1-: FB2.1 J4.7
TC1_CS: D3.C IC1.71((AD7)PA7)
TC2+: FB3.1 J4.1
TC2-: FB4.1 J4.3
TC2_CS: D5.C IC1.72((AD6)PA6)
TC3+: FB5.1 J4.18
TC3-: FB6.1 J4.20
TC3_CS: D7.C IC1.73((AD5)PA5)
TC4+: FB7.1 J4.14
TC4-: FB8.1 J4.16
TC4_CS: D9.C IC1.74((AD4)PA4)
TC5+: FB9.1 J4.10
TC5-: FB10.1 J4.12
TC5_CS: D11.C IC1.75((AD3)PA3)
TC6+: FB11.1 J4.6
TC6-: FB12.1 J4.8
TC6_CS: D13.C IC1.76((AD2)PA2)
TC7+: FB13.1 J4.2
TC7-: FB14.1 J4.4
TC7_CS: D15.C IC1.77((AD1)PA1)
TC8+: FB15.1 J5.17
TC8-: FB16.1 J5.19
TC8_CS: D17.C IC1.78((AD0)PA0)
TC9+: FB17.1 J5.13
TC9-: FB18.1 J5.15
TC9_CS: D19.C IC1.60((A15)PC7)
TC10+: FB19.1 J5.9
TC10-: FB20.1 J5.11
TC10_CS: D21.C IC1.59((A14)PC6)
TC_DO: IC1.26((OC0A/OC1C/PCINT7)PB7) IC2.7(DO) IC4.7(DO) IC5.7(DO) IC6.7(DO) IC7.7(DO) IC8.7(DO) IC9.7(DO) IC10.7(DO) IC11.7(DO) IC12.7(DO)
TC_SCK: D4.C D6.C D8.C D10.C D12.C D14.C D16.C D18.C D20.C D22.C IC1.25((OC1B/PCINT6)PB6)
THERM1+: J5.7 ; supply symbol labelled 5.0V
THERM1-: J5.5 R80.1
THERM2+: J5.3 ; supply symbol labelled 5.0V
THERM2-: J5.1 R81.1
TXD1: IC1.46((TXD1/INT3)PD3)
TXON: IC14.1(TXN) R53.1 SCK1.P$6(TX-)
TXOP: IC14.2(TXP) R52.2 SCK1.P$5(TX+)
VIN [24mil]: C5.+ C36.1 C37.+ C40.+ C42.2 IC3.1(VI) IC13.1(VI) IC18.1(VIN) J7.2 J7.4 J7.6 JP1.4 REG1.3(IN) REG2.3(IN)
VUSB [16mil]: C9.2 C10.2 CONN1.1(VCC) D2.A
WSV_2_SW- [24mil]: D27.1(A) J5.16
XTAL1: IC1.34(XTAL1) R2.1
XTAL2: IC1.33(XTAL2) R1.2 U$1.1
XTLN: C56.1 R51.2 XTL1.1(XTL1)
XTLP: C55.1 R51.1 XTL1.3(XTL2)
Unconnected: F1.1B F1.2B F2.1B F2.2B IC14.4(AVDD) IC14.7(DNC) IC14.8(AVDD) IC14.11(AVDD) IC14.12(NC) IC14.13(NC) IC14.15(AVDD) IC14.17(AVDD) IC14.18(VBG) IC14.20(TOCAP) IC14.21(AVDD) IC14.22(1V2O) IC14.23(RSVD) IC14.28(VDD) IC14.29(GND) IC14.37(RST_N) IC14.38(RSVD) IC14.39(RSVD) IC14.40(RSVD) IC14.41(RSVD) IC14.42(RSVD) IC14.43(PMODE2) IC14.44(PMODE1) IC14.45(PMODE0) IC14.46(NC) IC14.47(NC) J5.2 J5.4 J7.5 U5.13(XO) U6.13(XO) U7.13(XO) U8.13(XO) U$15.NC U$17.NC U$19.NC U$21.NC U$128.NC U$138.NC

## Notes on the sheet
- ATMEGA2560 Standalone Hardware Support | Power Distribution | 10 K-Type Thermocouples | Ethernet
- 1.8V / 3.3V Decoupling
- 3v3 Power Supply
- 5V Power / Reset
- D29
- D28
- D27\ | 12V Max
- D26 | From Supply
- D25
- D24
- D23
- D22
- D13 | pwm
- D12 | pwm
- D11 | pwm
- D10 | pwm
- D50/MISO | (MISO)
- D51/MOSI | (MOSI)
- D52/SCK | (SCK)
- D53 | (SS)
- D30 | Thrust Plate Load Cell ADCs
- D31
- D32
- D33
- D34
- LED Indicators
- D35
- D36
- D42 | D37
- D43
- D44 | D38
- pwm | D45
- pwm | D46
- D47
- D48 | D18/TX1
- D49 | D19/RX1
- D20/SDA
- A15 | D21/SCL
- A14
- (MISO)
- A13
- (SCK) | (MOSI)
- A12
- A11 | D3 | pwm
- A10 | D2 | pwm
- A9 | D5 | pwm
- A8
- D1/TX0 | pwm
- D0/RX0 | pwm
- A7
- A6
- A5
- A4
- D14/TX3 | A3
- D15/RX3 | A2
- A1
- A0
- pwm | D9
- pwm | D8 | D4 | pwm
- pwm | D7
- pwm | D6
- D39
- D16/TX2 | D40
- D17/RX2 | D41 | 5 Limit Switches | 2 Thermistors
- 16-bit ADC Support for Pressure Transducers | Solenoid Valve Actuation
- <- PoE supply feed
- to Arduino VIN
- VIN | + | - | GND
- For DC PoE feed, jumper "+ to VIN", "- to GND" directly
- I2C Address: 0x48 | I2C Address: 0x49 | I2C Address: 0x4A
- Hot Fire Board v2.0 | A

## Library data of the parts
AUX_BATT KEY_SW LEAD_ACID POWERSUPPLY = SparkFun-Connectors:CONN_02: Multi connection point. Often used as Generic Header-pin footprint for 0.1 inch spaced/style header connections On any of the 0.1 inch spaced packages, you can populate with these: Break Away Headers - Straight <https://www.sparkfun.com/products/116> (PRT-00116) Break Away Male Headers - Right Angle <https://www.sparkfun.com/products/553> (PRT-00553) Female Headers <https://www.sparkfun.com/products/115> (PRT-00115) Break Away Headers - Machine Pin <https://www.sparkfun.com/products/117> (PRT-00117) Break Away Female Headers - Swiss Machine Pin <https://www.sparkfun.com/products/743> (PRT-00743) For SCREWTERMINALS and SPRING TERMINALS visit here: Screw Terimnals on SparkFun.com <https://www.sparkfun.com/search/results?term=Screw+Terminals> (5mm/3.5mm/2.54mm spacing) This device is also useful as a general connection point to wire up your design to another part of your project. Our various solder wires solder well into these plated through hole pads. Hook-Up Wire - Assortment (Stranded, 22 AWG) <https://www.sparkfun.com/products/11375> (PRT-11375) Hook-Up Wire - Assortment (Solid Core, 22 AWG) <https://www.sparkfun.com/products/11367> (PRT-11367) View the entire wire category on our website here <https://www.sparkfun.com/categories/141> Special notes: Molex polarized connector foot print use with: PRT-08233 with associated crimp pins and housings. 2.54_SCREWTERM for use with PRT-10571. 3.5mm Screw Terminal footprints for PRT-08084 5mm Screw Terminal footprints for use with PRT-08432; SF_SKU: PRT-08432
C1-C4 C7-C23 C25-C35 C39 C43-C49 = microbuilder:CAP_CERAMIC: Ceramic Capacitors 0402 - 0402 Surface Mount Capacitors 16pF 50V 5% [Digikey: 445-4899-2-ND] 18pF 50V 5% [Digikey: 490-1281-2-ND] 22pF 50V 5% [Digikey: 490-1283-2-ND] 68pF 50V 5% [Digikey: 490-1289-2-ND] 0.1uF 10V 10% [Digikey: 490-1318-2-ND] 1.0uF 6.3V 10% [Digikey: 490-1320-2-ND] 0603 - 0603 Surface Mount Capacitors 16 pF 50V 5% [Digikey: 445-5051-2-ND] 22 pF 50V [Digikey: PCC220ACVTR-ND] 33 pF 50V 5% [Digikey: 490-1415-1-ND] 56pF 50V 5% [Digikey: 490-1421-1-ND] 220pF 50V 5% [Digikey: 445-1285-1-ND] 680 pF 50V 2200 pF 50V 5% C0G [Digikey: 445-1297-1-ND] 5600 pF 100V 5% X7R [Digikey: 478-3711-1-ND] 0.1 µF 25V 10% [Digikey: PCC2277TR-ND] 0.22 µF 16V 10% X7R [Digikey: 445-1318-1-ND] 1.0 µF 25V 10% [Digikey: 445-5146-2-ND] 0603 - RF Specific 3pF 250V +/-0.1pF RF [Digikey: 712-1347-1-ND] 18 pF 250V 5% [Digikey: 478-3505-1-ND or 712-1322-1-ND] 56 pF 250V 5% C0G RF [Digikey: 490-4867-1-ND] 68 pF 250V RF [Digikey: 490-4868-1-ND] 0805 - 0805 Surface Mount Capacitors 220 pF 250V 2% RF Ceramic Capacitor [Digikey: 712-1398-1-ND] 1000 pF 50V 2% NP0 Ceramic Capacitor [Digikey: 478-3760-1-ND] 0.1 µF 25V 10% Ceramic Capacitor [Digikey: PCC1828TR-ND] 1.0 µF 16V 10% Ceramic Capacitor[Digikey: 490-1691-2-ND] 10.0 µF 10V 10% Ceramic Capacitor[Digikey: 709-1228-1-ND] 10.0 uF 16V 10% Ceramic Capacitor [Digikey: 478-5165-2-ND] 47 uF 6.3V 20% Ceramic Capacitor [Digikey: 587-1779-1-ND or 399-5506-1-ND] 1206 - 1206 Surface Mount Capacitors 47uF 10V 20% Ceramic Capacitor [Digikey: 490-5528-1-ND or 399-5508-1-ND or 445-6010-1-ND]
C5 C6 C24 = rcl:CPOL-US: POLARIZED CAPACITOR, American symbol; SPICEPREFIX: C
C36 C54-C61 = freetronics:CAP: Capacitor Standard 0603 ceramic capacitor, and 0.1" leaded capacitor.
C37 C38 = rcl:CPOL-EU: POLARIZED CAPACITOR, European symbol
C40 C41 = microbuilder:CAP_ELECTROLYTIC: Electrolytic Capacitors PANASONIC_C - Size C Panasonic Electrolytic Aluminum Capacitor 47µF 16V 20% Electrolytic Capacitor [Digikey: PCE3890TR-ND] PANASONIC_D - Size D Panasonic Electrolytic Aluminum Capacitor 100µF 25V 20% Electrolytic Capacitor [Digikey: PCE3898TR-ND]
C42 = cap-master:CNP-: NON-POLARIZED CAP
C50-C53 = freetronics:CAP_POL: Capacitor Polarized These are standard SMD and PTH capacitors. Normally 10uF, 47uF, and 100uF in electrolytic and tantalum varieties. Always verify the external diameter of the through hole cap, it varies with capacity, voltage, and manufacturer. The EIA devices should be standard.
CONN1 = dodolcd:USB: USB connector
D1 D24 D26 D27 D39-D45 = diode:BAS40: Silicon Schottky Diodes General-purpose diode for high-speed switching
D2-D22 = microbuilder:DIODE: Diode SMADIODE - SMA Surface Mount Package 20V 1A Schottky Diode Digikey (500mV @ 1A, 500uA Vr @ 20V): 641-1014-6-ND 10V 2A Schottky Diode Digikey (350mV @ 2A, 700uA Vr @ 10V): MBRA210LT3 SOD-123 30V 200mA (800mV Vf, 2uA Vr @ 25V) Schottky Diode (very fast switching for boost, etc.) - Digikey: BAT54T1GOSTR-ND 30V 500mA (430mV Vf, 130uA Vr @ 30V) Schottky Diode - Digikey: B0530W-FDICT-ND MBR120 1A 20V (0.34Vf) Schottky Diode - Digikey: MBR120VLSFT1GOSCT-ND SOD-323 10V 570mA (380mV Vf, 3ns) Schottky Diode - Digikey: ZLLS410CT-ND 1N4148WS - 75V 150mA (1V Vf @ 10mA, 4ns) Simple Diode - Digikey: 1N4148WSFSCT-ND, Mouser: 512-1N4148WS SOD-523 BAT54 30V 200mA Schottky (0.8 Vf @ 100mA, 5ns) - Digikey: BAT54XV2CT-ND 30V 30mA Schottky Diode (RB751S-40TE61) - Digikey: RB751S-40TE61CT-ND SOT23-R/W - SOT23 Package (R = Solder Paste/Reflow Ovens, W = Hand-Soldering) BAT54Film 40V 300mA - Digikey: 497-7162-1-ND DO-1N4148 Through Hole Small Current Diode (any model)
D23 = s3x_10:S3*: S3A - S3N General Purpose Rectifiers Source: http://www.fairchildsemi.com/datasheets/S3/S3A.pdf; MF: Fairchild; MPN: S3G; OC_FARNELL: 2454094; OC_NEWARK: 58K2397
F1 F2 = fuse:SHK20L: FUSE HOLDER 5 x 20 mm, SH contact, SHH1 Schukat, E1073 Buerklin; OC_FARNELL: unknown; OC_NEWARK: unknown
FB1-FB20 = microbuilder:FERRITE: Ferrite Bead 0603 MMZ1608B121C - 120 Ohm, 600mA Ferrite Chip - Digikey: 445-2164-1-ND BK1608HW121-T - 120 Ohm, 600mA Ferrite Chip - Digikey: 587-1876-2-ND
H1-H4 = holes:MOUNT-HOLE: MOUNTING HOLE with drill center marker
IC1 = atmel-2005:ATMEGA*: MICROCONTROLLER 64/128/256 Kbytes FLASH 4 Kbytes EEPROM 8 Kbytes SRAM 86 General Purpose I/O pins 12-channels16-bit PWM 4 x Serial USARTs 16-channels 10-bit A/D
IC2 IC4-IC12 = adafruit:MAX6675
IC3 IC13 = adafruit:78*: Positive VOLTAGE REGULATOR Added bigger pads to the TO-92 package
IC14 = W5500:W5500
IC18 = national-semiconductor:LM2596: SIMPLE SWITCHER® Power Converter 150 kHz 3A Step-Down Voltage Regulator Source: http://www.national.com/ds/LM/LM2596.pdf; MF: NATIONAL SEMICONDUCTOR; MPN: LM2596S-ADJ/NOPB; OC_FARNELL: 9494367; OC_NEWARK: 41K3842
ICSP J7 = SparkFun-Connectors:CONN_03X2: Multi connection point. Often used as Generic Header-pin footprint for 0.1 inch spaced/style header connections You can populate with any combo of single row headers, but if you'd like an exact match, check these: Header - 2x3 (Male, 0.1") <https://www.sparkfun.com/products/12807> (PRT-12807) Header - 2x3 (Female, 0.1") <https://www.sparkfun.com/products/13010> (PRT-13010) 2x3 Pin Shrouded Header <https://www.sparkfun.com/products/10877> (PRT-10877) On any of the 0.1 inch spaced packages, you can populate with these: Break Away Headers - Straight <https://www.sparkfun.com/products/116> (PRT-00116) Break Away Male Headers - Right Angle <https://www.sparkfun.com/products/553> (PRT-00553) Female Headers <https://www.sparkfun.com/products/115> (PRT-00115) Break Away Headers - Machine Pin <https://www.sparkfun.com/products/117> (PRT-00117) Break Away Female Headers - Swiss Machine Pin <https://www.sparkfun.com/products/743> (PRT-00743) Special note: the shrouded connector mates well with our 3x2 ribbon cables: Ribbon Crimp Connector - 6-pin (2x3, Female) <https://www.sparkfun.com/products/10651> (PRT-10651) Ribbon Cable - 6 wire (15ft) <https://www.sparkfun.com/products/10646> (PRT-10646); PROD_ID: CONN-11566
J1-J5 = con-amp:2-794681-0: Micro MATE-N-LOK Connectors grid 1.5mm Dual Row Through Hole Vertical Metal Through Hole Holddowns Source: ENG_CD_794681_E.pdf
JP1 = freetronics:M04: Header 4 Standard 4-pin 0.1" header. Use with straight break away headers (SKU : PRT-00116), right angle break away headers (PRT-00553), swiss pins (PRT-00743), machine pins (PRT-00117), and female headers (PRT-00115). Molex polarized connector foot print use with SKU : PRT-08231 with associated crimp pins and housings.
L1 = inductor-bourns:SRR1280: POWER INDUCTOR
L2 L3 = rcl:L-US: INDUCTOR, American symbol
LED1-LED4 = microbuilder:LED: LED 0603 - 0603 Surface Mount Package 2mA: Green LED - Low Power (3.9mcd, 2ma, 1.7Vf) - Digikey: 475-2709-2-ND Orange LED - Low Power (9.8mcd, 2ma, 1.8Vf) - Digikey: 475-1194-2-ND Red LED - Low Power (5mcd, 2ma, 1.8Vf) - Digikey: 475-1195-2-ND Yellow LED - Low Power (7mcd, 2ma, 1.8Vf) - Digikey: 475-1196-2-ND 5mA: Blue LED - Low Power (17mcd, 5ma, 2.9Vf) - Digikey: LNJ937W8CRACT-ND 0805 - 0805 Surface Mount Package 2mA: Red LED (8.8mcd, 2mA, 1.8Vf, Clear) - Low Power [Digikey: 475-2510-1-ND] Green LED (5mcd, 2mA, 1.8Vf, Clear) - Low Power [Digikey: 475-2730-1-ND] Yellow LED (11.3mcd, 2mA, 1.8Vf, Clear) - Low Power [Digikey: 475-2555-1-ND] 20mA: Red LED (104mcd, 20mA, Diffused) - LS R976 [Digikey: 475-1278-6-ND] Red LED (12mcd, 20mA, 2.0Vf, Clear) - APT2012EC [Digikey: 754-1128-1-ND] Green LED (15mcd, 20mA, 2.2Vf, Clear) - APT2012GC [Digikey: 754-1131-1-ND] Orange LED (160mcd, 20mA, 2.1Vf, Clear) - APT2012SECK [Digikey: 754-1130-1-ND] 1206 - 1206 Surface Mount Package Green LED (26mcd, 20mA, Diffused) - LG N971 [Digikey: 475-1407-6-ND] Red LED (15mcd, 20mA, Diffused) - LH N974 [Digikey: 475-1416-6-ND]
LED5-LED9 = freetronics:LED: LEDs Standard schematic elements and footprints for 5mm, 3mm, 1206, and 0603 sized LEDs. 5mm - Spark Fun Electronics SKU : COM-00529 (and others)
Q1-Q4 = User-Submitted:TRANSISTOR_PNP: Generic PNP BJT Double check pinouts against datasheets- not all devices are the same! MMBT3906 - 40V 200mA SOT-23 (TRANS-08052) MMBT4403 - 40V 600mA SOT-23 (TRANS-09245)
Q5-Q9 = SparkFun:TRANSISTOR_NPN: Transistor NPN BJT configuration in SOT23 package. MMBT2222 is the common NPN we use. Double check BCE configuration again layout.
R1-R45 R75-R79 R82 R83 R86 R88-R90 = microbuilder:RESISTOR: Resistors 0402 - 0402 Surface Mount Package 22 Ohm 1% 1/16W [Digikey: 311-22.0LRTR-ND] 33 Ohm 5% 1/16W 1.0K 5% 1/16W 1.5K 5% 1/16W 2.0K 1% 1/16W 10.0K 1% 1/16W [Digikey: 311-10.0KLRTR-ND] 10.0K 5% 1/16W [Digikey: RMCF0402JT10K0TR-ND] 12.1K 1% 1/16W [Digikey: 311-22.0LRTR-ND] 100.0K 5% 1/16W 0603 - 0603 Surface Mount Package 0 Ohm 1/10 Watt 1% Resistor 15 Ohm 1/10 Watt 1% Resistor 33 Ohm 1/10 Watt 1% Resistor 49.9 Ohm 1/10 Watt 1% Resistor 100 Ohm 1/10 Watt 1% Resistor 150 Ohm 1/10 Watt 1% Resistor 240 Ohm 1/10 Watt 1% Resistor 390 Ohm 1/10 Watt 1% Resistor 560 Ohm 1/10 Watt 1% Resistor 680 Ohm 1/10 Watt 1% Resistor 750 Ohm 1/10 Watt 1% Resistor 1.0K Ohm 1/10 Watt 1% Resistor 1.5K Ohm 1/10 Watt 1% Resistor 2.0K Ohm 1/10 Watt 1% Resistor 2.2K Ohm 1/10 Watt 1% Resistor 3.3K Ohm 1/10 Watt 1% Resistor 4.7K Ohm 1/10 Watt 1% Resistor 10.0K Ohm 1/10 Watt 1% Resistor 12.0K Ohm 1/10 Watt 1% Resistor 12.1K Ohm 1/10 Watt 1% Resistor 20.0K Ohm 1/10 Watt 1% Resistor 33.0K Ohm 1/10 Watt 1% Resistor 100.0K Ohm 1/10 Watt 1% Resistor 0805 - 0805 Surface Mount Package 0 Ohm 1/8 Watt 1% Resistor 33 Ohm 1/8 Watt 1% Resistor 100 Ohm 1/8 Watt 1% Resistor 150 Ohm 1/8 Watt 1% Resistor 200 Ohm 1/8 Watt 1% Resistor 240 Ohm 1/8 Watt 1% Resistor 330 Ohm 1/8 Watt 1% Resistor 390 Ohm 1/8 Watt 1% Resistor 470 Ohm 1/8 Watt 1% Resistor 1.0K Ohm 1/8 Watt 1% Resistor 1.5K Ohm 1/8 Watt 1% Resistor 2.0K Ohm 1/8 Watt 1% Resistor 4.7K Ohm 1/8 Watt 1% Resistor 5.1K Ohm 1/8 Watt 1% Resistor 5.6K Ohm 1/8 Watt 1% Resistor 10.0K Ohm 1/8 Watt 1% Resistor 22.0K Ohm 1/8 Watt 1% Resistor 33.0K Ohm 1/8 Watt 1% Resistor 100K Ohm 1/8 Watt 1% Resistor 1206 - 1206 Surface Mount Package 2012 - 2010 Surface Mount Package 0.11 Ohm 1/2 Watt 1% Resistor - Digikey: RHM.11UCT-ND
R46-R59 = freetronics:RESISTOR: Resistor Basic schematic elements and footprints for 0603, 1206, and PTH 1/10th watt (small) resistors.
R80 R81 R85 = adafruit:R-US_: RESISTOR, American symbol
R84 = pot:TRIM_US-: POTENTIOMETER
REG1 REG2 = freetronics:V_REG_LM1117: Voltage Regulator LD1117 Adjustable low-dropout voltage regulator available in SOT89 and SOT223 SMT packages.
S1 = switch-tact:DTSM-6
SCK1 = freetronics-jon:HY931147C
SW1 = freetronics-master-v1:TAC_SWITCH_2PIN: Momentary Tactile Switch - 2 pin
U1 = microbuilder:FT232RL: FTDI FT232RL USB TO RS232 Converter Digikey: 768-1007-1-ND
U2-U4 = microbuilder:ADC_ADS1015: ADS1015 - 12-bit 4-Channel I2C ADC with Internal PGA VDD: 2.0-5.5V Sampling Rate: 3.3ksps Gain Settings: 2/3, 1, 2, 4, 8, 16 I2C Address: ADDR low = 1001000x, ADDR high = 1001001x Internal Comparator The ADS1015 includes an internal comparator that can be set to output a high-level on ALERT when the conversion results exceeeds a pre-defined upper level, and will deassert itself when the level falls below a pre-defined lower threshold level. It can also be set to windowed mode where the ALERT pin will be asserted if the data exceeds the upper threshold or falls below the lower threshold.
U5-U8 = SparkFun-IC-Conversion:HX711: AVIA Semiconductor HX711 - ADC 24-Bit Analog-to-Digital Converter for Weigh Scales Datasheet <https://cdn.sparkfun.com/datasheets/Sensors/ForceFlex/hx711_english.pdf> SparkFun Products: SparkFun Load Cell Amplifier - HX711 <https://www.sparkfun.com/products/13879>; PROD_ID: IC-12445
U$1 = SparkFun:RESONATOR: Resonator Small SMD resonator. This is the itty bitty 10/20MHz resonators with built in caps. CSTCE10M0G55 and CSTCE20M0V53. Footprint has been reviewed closely but hasn't been tested yet.
U$15 U$17 U$19 U$21 U$128 U$138 = goodsky1:RW-SH
XTL1 = freetronics-jon:CRYSTAL-GND

## Net classes
1 16mil: width 0.254 mm, drill 0.254 mm, clearance 0.127 mm
2 24mil: width 0.254 mm, drill 0.254 mm, clearance 0.127 mm
3 32mil: width 0.254 mm, drill 0.254 mm, clearance 0.127 mm